# EAGLE design osi-blink_rev_0 (EAGLE 6.3)
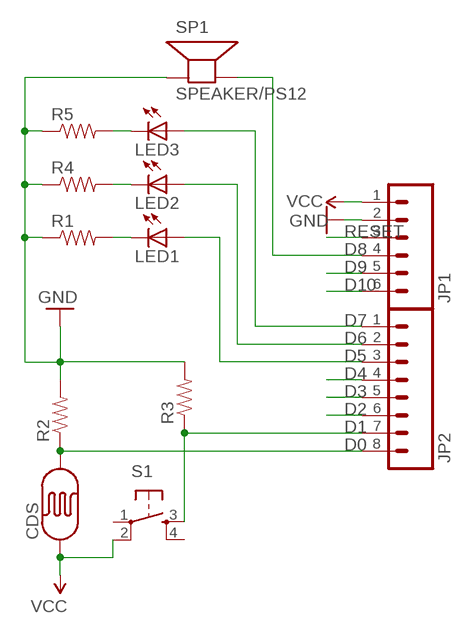
[diagram p0: schematic, sheet 1]

## Parts
CDS  PHOTOCELLPTH-KIT  [PHOTOCELL-KIT]
JP1  M06SIP  [1X06]
JP2  M081X08  [1X08]
LED1  LED3MM  [LED3MM]
LED2  LED3MM  [LED3MM]
LED3  LED3MM  [LED3MM]
R1  RESISTORKIT  [AXIAL-0.3-KIT]
R2  RESISTORKIT  [AXIAL-0.3-KIT]
R3  RESISTORKIT  [AXIAL-0.3-KIT]
R4  RESISTORKIT  [AXIAL-0.3-KIT]
R5  RESISTORKIT  [AXIAL-0.3-KIT]
S1  TAC_SWITCHPTH  [TACTILE-PTH]
SP1  SPEAKER/PS12  [PS12]

## Nets
D0: CDS.2 JP2.8 R2.P$1
D1: JP2.7 R3.P$1 S1.3
D2: JP2.6
D3: JP2.5
D4: JP2.4
D5: JP2.3 LED1.A
D6: JP2.2 LED2.A
D7: JP2.1 LED3.A
D8: JP1.4 SP1.P$2(-)
D9: JP1.5
D10: JP1.6
GND: JP1.2 R1.P$1 R2.P$2 R3.P$2 R4.P$1 R5.P$1 SP1.P$1(+)
N$1: LED1.K(C) R1.P$2
N$2: LED2.K(C) R4.P$2
N$3: LED3.K(C) R5.P$2
RESET: JP1.3
VCC: CDS.1 JP1.1 S1.2
Unconnected: S1.1 S1.4

## Library data of the parts
CDS = SparkFun_mod:PHOTOCELL: Photocell Also known as a CdS photoresistor. This is a low cost way to detect light levels. Resistance decreases with more incoming light. SparkFun SKU: SEN-09088
JP1 = SparkFun_mod:M06: Header 6 Standard 6-pin 0.1" header. Use with straight break away headers (SKU : PRT-00116), right angle break away headers (PRT-00553), swiss pins (PRT-00743), machine pins (PRT-00117), and female headers (PRT-00115). Molex polarized connector foot print use with SKU : PRT-08094 with associated crimp pins and housings. NOTES ON THE VARIANTS LOCK and LOCK_LONGPADS... This footprint was designed to help hold the alignment of a through-hole component (i.e. 6-pin header) while soldering it into place. You may notice that each hole has been shifted either up or down by 0.005 of an inch from it's more standard position (which is a perfectly straight line). This slight alteration caused the pins (the squares in the middle) to touch the edges of the holes. Because they are alternating, it causes a "brace" to hold the component in place. 0.005 has proven to be the perfect amount of "off-center" position when using our standard breakaway headers. Although looks a little odd when you look at the bare footprint, once you have a header in there, the alteration is very hard to notice. Also, if you push a header all the way into place, it is covered up entirely on the bottom side. This idea of altering the position of holes to aid alignment will be further integrated into the Sparkfun Library for other footprints. It can help hold any component with 3 or more connection pins.
JP2 = SparkFun_mod:M08: Header 8 Standard 8-pin 0.1" header. Use with straight break away headers (SKU : PRT-00116), right angle break away headers (PRT-00553), swiss pins (PRT-00743), machine pins (PRT-00117), and female headers (PRT-00115).
LED1-LED3 = adafruit:LED: LED OSRAM: - CHIPLED LG R971, LG N971, LY N971, LG Q971, LY Q971, LO R971, LY R971 LH N974, LH R974 LS Q976, LO Q976, LY Q976 LO Q996 - Hyper CHIPLED LW Q18S LB Q993, LB Q99A, LB R99A - SideLED LS A670, LO A670, LY A670, LG A670, LP A670 LB A673, LV A673, LT A673, LW A673 LH A674 LY A675 LS A676, LA A676, LO A676, LY A676, LW A676 LS A679, LY A679, LG A679 - Hyper Micro SIDELED® LS Y876, LA Y876, LO Y876, LY Y876 LT Y87S - SmartLED LW L88C, LW L88S LB L89C, LB L89S, LG L890 LS L89K, LO L89K, LY L89K LS L896, LA L896, LO L896, LY L896 - TOPLED LS T670, LO T670, LY T670, LG T670, LP T670 LSG T670, LSP T670, LSY T670, LOP T670, LYG T670 LG T671, LOG T671, LSG T671 LB T673, LV T673, LT T673, LW T673 LH T674 LS T676, LA T676, LO T676, LY T676, LB T676, LH T676, LSB T676, LW T676 LB T67C, LV T67C, LT T67C, LS T67K, LO T67K, LY T67K, LW E67C LS E67B, LA E67B, LO E67B, LY E67B, LB E67C, LV E67C, LT E67C LW T67C LS T679, LY T679, LG T679 LS T770, LO T770, LY T770, LG T770, LP T770 LB T773, LV T773, LT T773, LW T773 LH T774 LS E675, LA E675, LY E675, LS T675 LS T776, LA T776, LO T776, LY T776, LB T776 LHGB T686 LT T68C, LB T68C - Hyper Mini TOPLED® LB M676 - Mini TOPLED Santana® LG M470 LS M47K, LO M47K, LY M47K Source: http://www.osram.convergy.de/
R1-R5 = SparkFun_mod:RESISTOR: Resistor Basic schematic elements and footprints for 0603, 1206, and PTH resistors.
S1 = SparkFun_mod:TAC_SWITCH: Momentary Switch Button commonly used for reset or general input. Spark Fun Electronics SKU : COM-00097
SP1 = adafruit_mod:SPEAKER: SPEAKER Source: Buerklin Added PS12 (for part # PS1240 piezo) http://www.ladyada.net/library/pcb/eaglelibrary.html

## Board
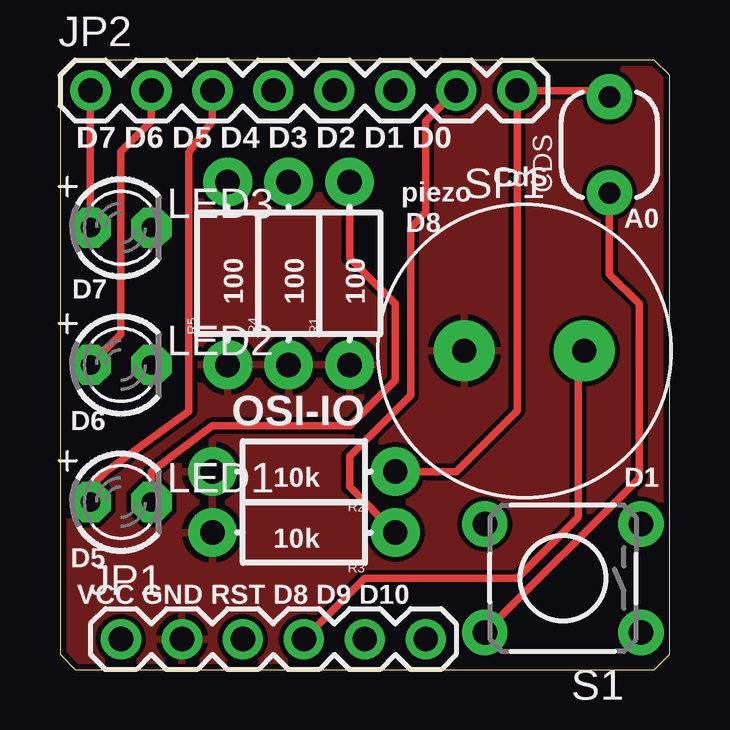
[diagram p1: board, top side]
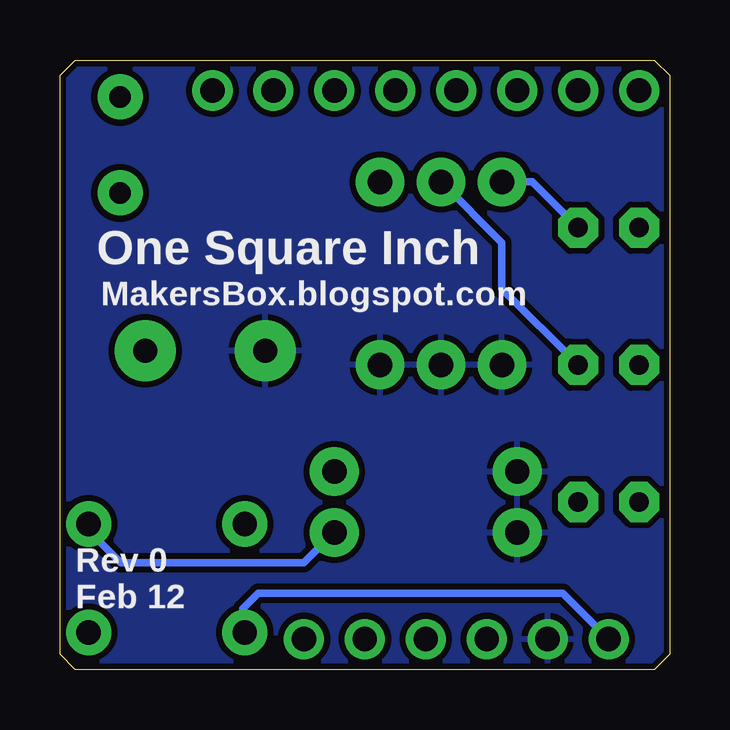
[diagram p2: board, bottom side, seen from below]

Size 25.4 x 25.4 mm. Coordinates in mm from the lower left corner, seen from the top.
Outline: 0,24.77 0.64,25.4 24.77,25.4 24.77,25.4 25.4,24.77 25.4,0.64 24.77,0 24.77,0 0.64,0 0,0.64 0,24.77
Outline: 0,24.77 0,24.77
Copper layers (1*16): Top 0.035mm / dielectric 1.5mm / Bottom 0.035mm
Design rules "SparkFun": minimum track width 8mil, minimum drill 20mil, track to track 8mil, track to pad 8mil, pad to pad 8mil, via to via 8mil, smd to smd 8mil, copper to edge 10mil, drill to drill 8mil, minimum pad ring 12mil, minimum via ring 10mil, stop-mask expansion 4mil, vias tented up to drill 25mil, thermal gap 10mil

### Footprints (pad centres in the part's own frame; a part is rotated, then mirrored left to right if it is on the bottom)
PHOTOCELL-KIT = drill 0.9 pad 1.88: 1 -2,0; 2 2,0
1X06 = drill 1.016 pad 1.676: 1 0,0; 2 2.54,0; 3 5.08,0; 4 7.62,0; 5 10.16,0; 6 12.7,0
1X08 = drill 1.016 pad 1.676: 1 0,0; 2 2.54,0; 3 5.08,0; 4 7.62,0; 5 10.16,0; 6 12.7,0; 7 15.24,0; 8 17.78,0
LED3MM = drill 0.813 pad 1.676 octagon: A -1.27,0; K 1.27,0
AXIAL-0.3-KIT = drill 1.016 pad 2.032: P$1 -3.81,0; P$2 3.81,0
TACTILE-PTH = drill 1.016 pad 1.88: 1 -3.251,2.261; 2 3.251,2.261; 3 -3.251,-2.261; 4 3.251,-2.261
PS12 = drill 1 pad 2.54: P$1 -2.5,0; P$2 2.5,0

### Placement (x,y rotation side)
CDS  22.9,21.87 90 top
JP1  2.54,1.27 0 top
JP2  1.27,24.13 0 top
LED1  2.54,6.99 0 top
LED2  2.54,12.7 0 top
LED3  2.54,18.41 0 top
R1  12.06,16.51 90 top
R2  10.16,8.26 180 top
R3  10.16,5.71 180 top
R4  9.53,16.51 90 top
R5  6.99,16.51 90 top
S1  20.95,3.81 180 top
SP1  19.35,13.28 0 top

### Tracks (layer width: path | path; a pad name or v marks a point on that pad's centre or on a via)
D0
  Top 0.305: R2.P$1 16.51,8.26 19.05,10.79 JP2.8 22.63,24.13 CDS.2
D1
  Top 0.305: R3.P$1 12.06,7.62 12.06,8.89 14.61,11.43 14.61,18.41 15.24,19.05 15.24,22.86 JP2.7
  Bottom 0.305: S1.3 24.21,5.79 22.86,4.45 15.24,4.45 R3.P$1
D5
  Top 0.305: JP2.3 6.35,22.86 5.37,21.57 5.37,10.77 1.91,8.26 1.27,7.62 LED1.A
D6
  Top 0.305: JP2.2 3.81,22.86 2.54,21.59 2.54,13.97 LED2.A
D7
  Top 0.305: JP2.1 LED3.A
D8
  Top 0.305: JP1.4 12.7,3.81 19.05,3.81 21.59,6.35 21.59,13.02 SP1.P$2
GND
  pour Bottom (isolate 0.254): -1.27,26.67 26.67,26.67 26.67,-1.27 -1.27,-1.27
  pour Top: -0.64,26.04 26.67,26.04 26.67,0 26.04,-0.64 -0.64,-0.64
N$1
  Top 0.305: R1.P$2 12.06,17.14 13.97,15.24 13.97,12.06 12.06,10.16 6.35,10.16 3.81,8.26 LED1.K
N$2
  Bottom 0.305: R4.P$2 6.99,17.78 6.99,15.88 LED2.K
N$3
  Bottom 0.305: R5.P$2 5.71,20.32 LED3.K
VCC
  Top 0.305: CDS.1 22.9,16.47 24.13,15.24 24.13,7.98 S1.2
  Bottom 0.305: JP1.1 4.45,3.17 17.14,3.17 17.78,2.54 17.78,1.63 S1.2

### Text on the board
tPlace: D7 D6 D5 D4 D3 D2 D1 D0 | CdS | piezo | D8 | A0 | D7 | 100 | 100 | 100 | D6 | OSI-IO | 10k | D1 | D5 | 10k | VCC GND RST D8 D9 D10
bPlace: One Square Inch | MakersBox.blogspot.com | Rev 0 / Feb 12